# EAGLE design mainboard_teensy41 (EAGLE 9.6.0)
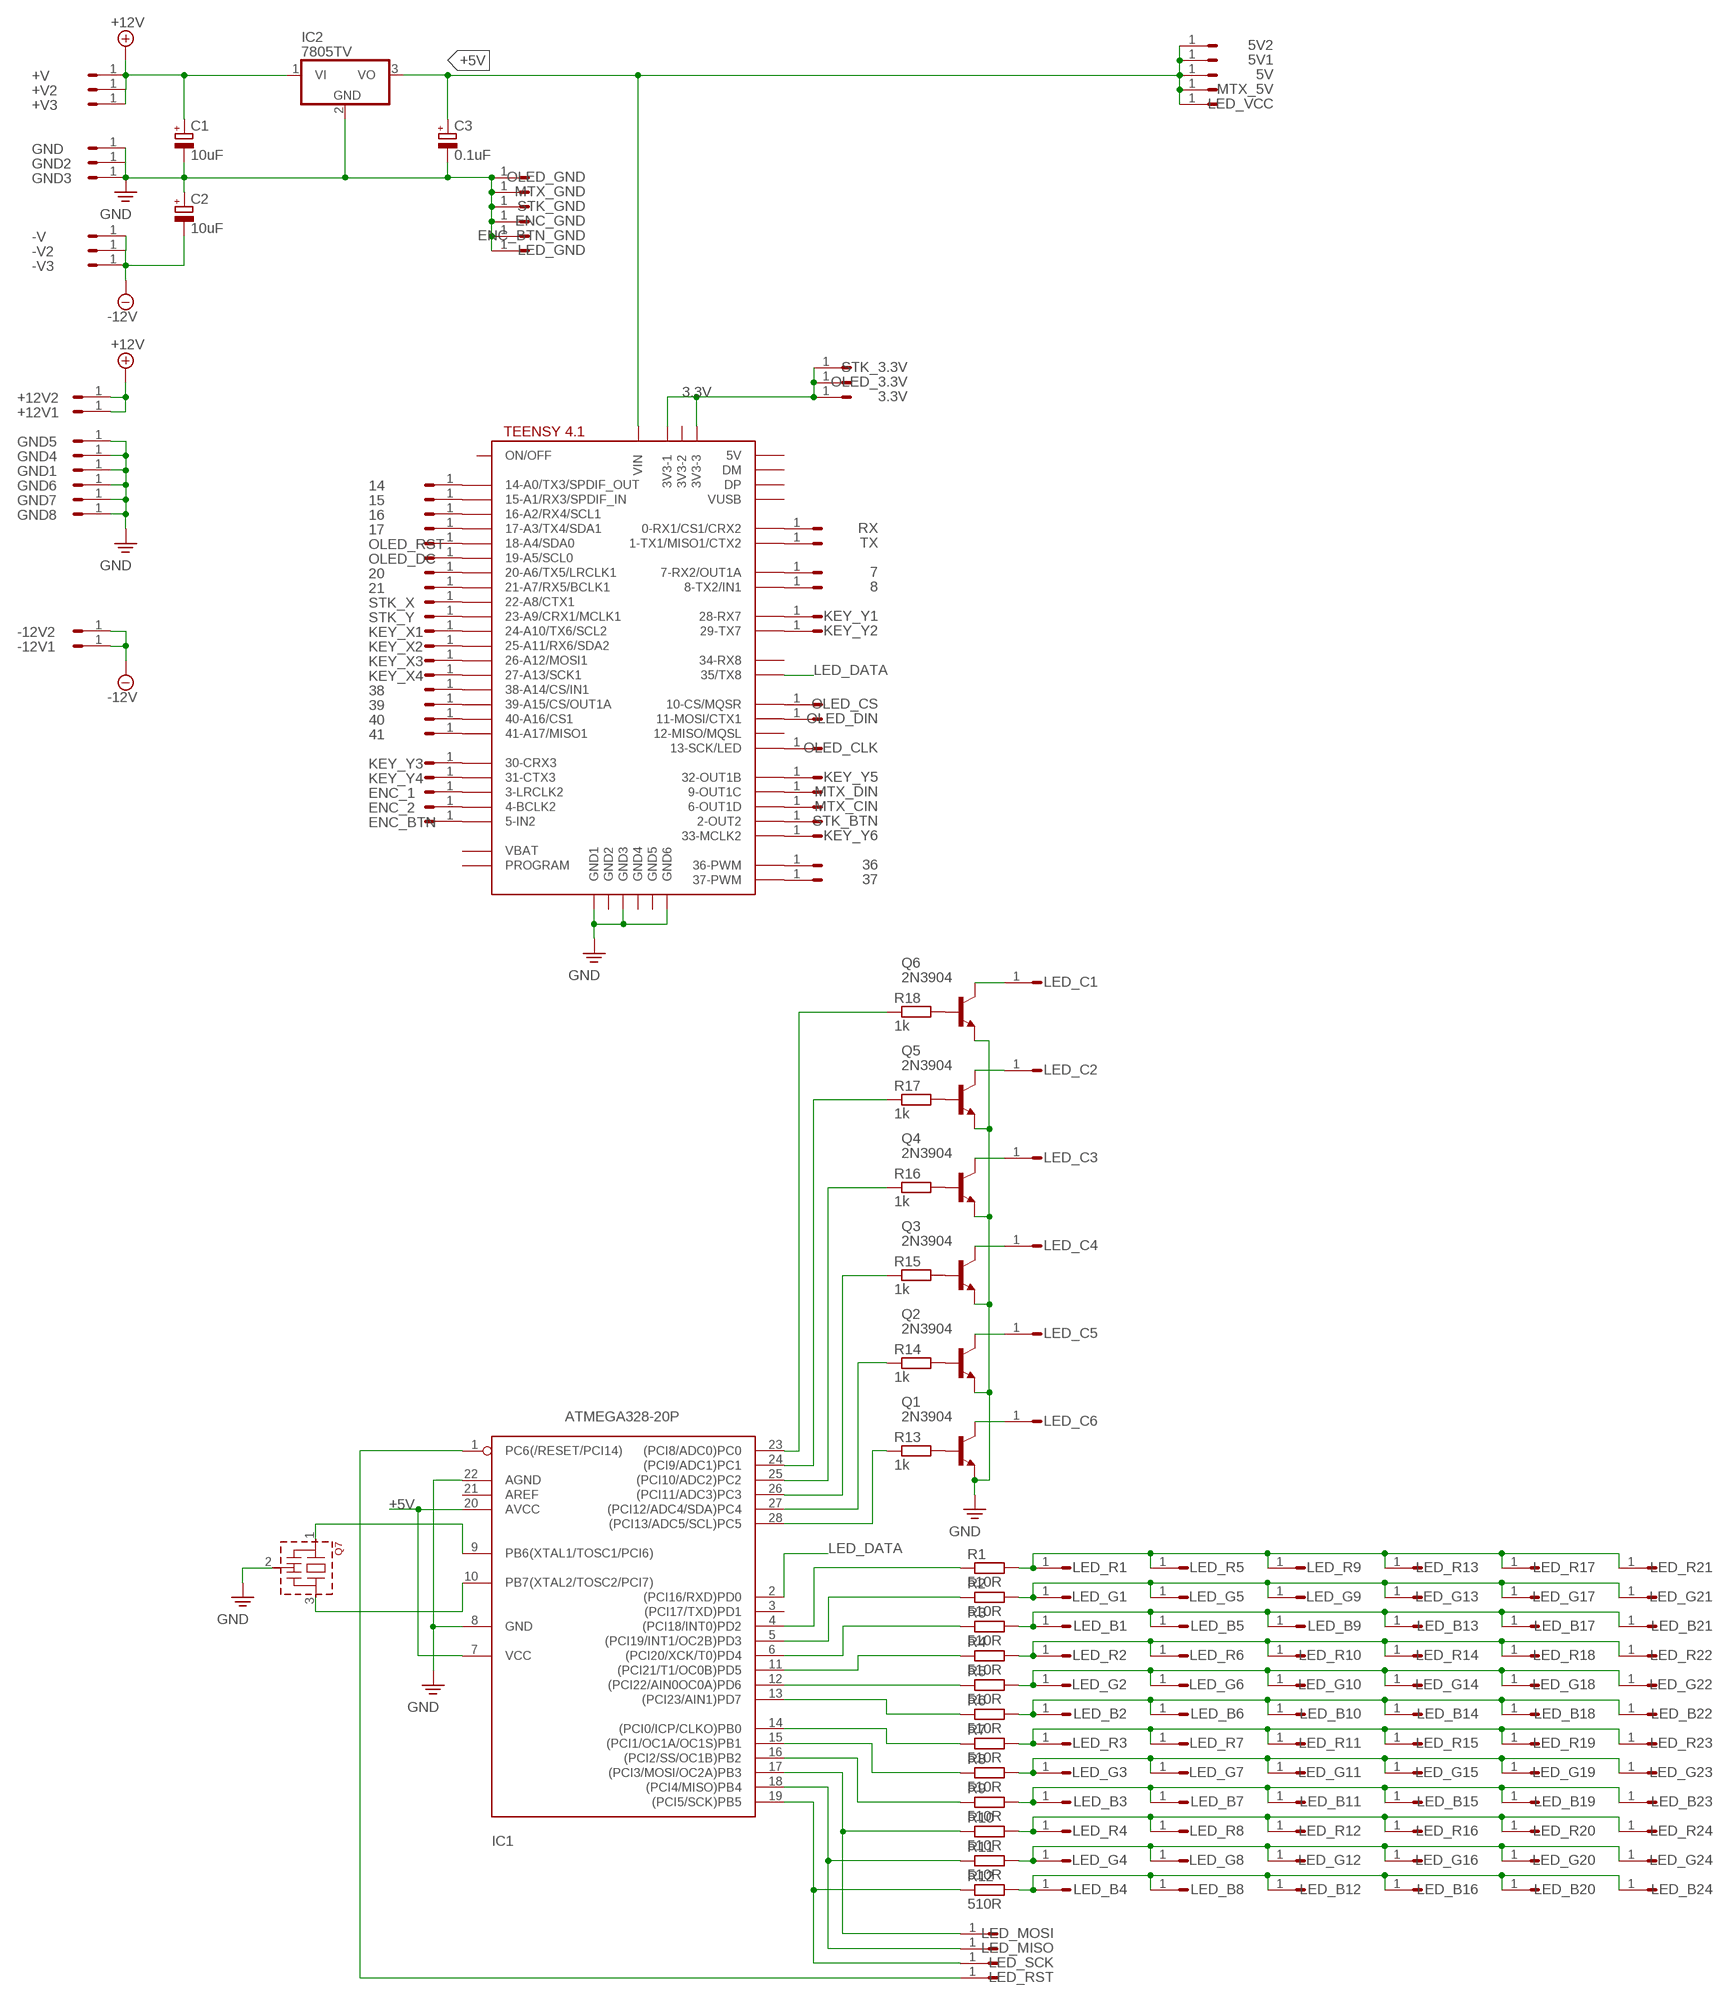
[diagram p0: schematic, sheet 1]

## Parts
3.3V  HEADER/MALE/01  [HEADER/MALE/01]
5V  HEADER/MALE/01  [HEADER/MALE/01]
5V1  HEADER/MALE/01  [HEADER/MALE/01]
5V2  HEADER/MALE/01  [HEADER/MALE/01]
7  HEADER/MALE/01  [HEADER/MALE/01]
8  HEADER/MALE/01  [HEADER/MALE/01]
14  HEADER/MALE/01  [HEADER/MALE/01]
15  HEADER/MALE/01  [HEADER/MALE/01]
16  HEADER/MALE/01  [HEADER/MALE/01]
17  HEADER/MALE/01  [HEADER/MALE/01]
20  HEADER/MALE/01  [HEADER/MALE/01]
21  HEADER/MALE/01  [HEADER/MALE/01]
36  HEADER/MALE/01  [HEADER/MALE/01]
37  HEADER/MALE/01  [HEADER/MALE/01]
38  HEADER/MALE/01  [HEADER/MALE/01]
39  HEADER/MALE/01  [HEADER/MALE/01]
40  HEADER/MALE/01  [HEADER/MALE/01]
41  HEADER/MALE/01  [HEADER/MALE/01]
+12V1  HEADER/MALE/01  [HEADER/MALE/01]
+12V2  HEADER/MALE/01  [HEADER/MALE/01]
+V  HEADER/MALE/01  [HEADER/MALE/01]
+V2  HEADER/MALE/01  [HEADER/MALE/01]
+V3  HEADER/MALE/01  [HEADER/MALE/01]
-12V1  HEADER/MALE/01  [HEADER/MALE/01]
-12V2  HEADER/MALE/01  [HEADER/MALE/01]
-V  HEADER/MALE/01  [HEADER/MALE/01]
-V2  HEADER/MALE/01  [HEADER/MALE/01]
-V3  HEADER/MALE/01  [HEADER/MALE/01]
C1  10uF  CAPACITOR/POLARIZEDE2.5-6  [E2,5-6]
C2  10uF  CAPACITOR/POLARIZEDE2.5-6  [E2,5-6]
C3  0.1uF  CAPACITOR/POLARIZEDE2.5-6  [E2,5-6]
ENC_1  HEADER/MALE/01  [HEADER/MALE/01]
ENC_2  HEADER/MALE/01  [HEADER/MALE/01]
ENC_BTN  HEADER/MALE/01  [HEADER/MALE/01]
ENC_BTN_GND  HEADER/MALE/01  [HEADER/MALE/01]
ENC_GND  HEADER/MALE/01  [HEADER/MALE/01]
GND  HEADER/MALE/01  [HEADER/MALE/01]
GND1  HEADER/MALE/01  [HEADER/MALE/01]
GND2  HEADER/MALE/01  [HEADER/MALE/01]
GND3  HEADER/MALE/01  [HEADER/MALE/01]
GND4  HEADER/MALE/01  [HEADER/MALE/01]
GND5  HEADER/MALE/01  [HEADER/MALE/01]
GND6  HEADER/MALE/01  [HEADER/MALE/01]
GND7  HEADER/MALE/01  [HEADER/MALE/01]
GND8  HEADER/MALE/01  [HEADER/MALE/01]
IC1  ATMEGA328-20P  [DIL28-3]
IC2  7805TV  [TO220V]
KEY_X1  HEADER/MALE/01  [HEADER/MALE/01]
KEY_X2  HEADER/MALE/01  [HEADER/MALE/01]
KEY_X3  HEADER/MALE/01  [HEADER/MALE/01]
KEY_X4  HEADER/MALE/01  [HEADER/MALE/01]
KEY_Y1  HEADER/MALE/01  [HEADER/MALE/01]
KEY_Y2  HEADER/MALE/01  [HEADER/MALE/01]
KEY_Y3  HEADER/MALE/01  [HEADER/MALE/01]
KEY_Y4  HEADER/MALE/01  [HEADER/MALE/01]
KEY_Y5  HEADER/MALE/01  [HEADER/MALE/01]
KEY_Y6  HEADER/MALE/01  [HEADER/MALE/01]
LED_B1  HEADER/MALE/01  [HEADER/MALE/01]
LED_B2  HEADER/MALE/01  [HEADER/MALE/01]
LED_B3  HEADER/MALE/01  [HEADER/MALE/01]
LED_B4  HEADER/MALE/01  [HEADER/MALE/01]
LED_B5  HEADER/MALE/01  [HEADER/MALE/01]
LED_B6  HEADER/MALE/01  [HEADER/MALE/01]
LED_B7  HEADER/MALE/01  [HEADER/MALE/01]
LED_B8  HEADER/MALE/01  [HEADER/MALE/01]
LED_B9  HEADER/MALE/01  [HEADER/MALE/01]
LED_B10  HEADER/MALE/01  [HEADER/MALE/01]
LED_B11  HEADER/MALE/01  [HEADER/MALE/01]
LED_B12  HEADER/MALE/01  [HEADER/MALE/01]
LED_B13  HEADER/MALE/01  [HEADER/MALE/01]
LED_B14  HEADER/MALE/01  [HEADER/MALE/01]
LED_B15  HEADER/MALE/01  [HEADER/MALE/01]
LED_B16  HEADER/MALE/01  [HEADER/MALE/01]
LED_B17  HEADER/MALE/01  [HEADER/MALE/01]
LED_B18  HEADER/MALE/01  [HEADER/MALE/01]
LED_B19  HEADER/MALE/01  [HEADER/MALE/01]
LED_B20  HEADER/MALE/01  [HEADER/MALE/01]
LED_B21  HEADER/MALE/01  [HEADER/MALE/01]
LED_B22  HEADER/MALE/01  [HEADER/MALE/01]
LED_B23  HEADER/MALE/01  [HEADER/MALE/01]
LED_B24  HEADER/MALE/01  [HEADER/MALE/01]
LED_C1  HEADER/MALE/01  [HEADER/MALE/01]
LED_C2  HEADER/MALE/01  [HEADER/MALE/01]
LED_C3  HEADER/MALE/01  [HEADER/MALE/01]
LED_C4  HEADER/MALE/01  [HEADER/MALE/01]
LED_C5  HEADER/MALE/01  [HEADER/MALE/01]
LED_C6  HEADER/MALE/01  [HEADER/MALE/01]
LED_G1  HEADER/MALE/01  [HEADER/MALE/01]
LED_G2  HEADER/MALE/01  [HEADER/MALE/01]
LED_G3  HEADER/MALE/01  [HEADER/MALE/01]
LED_G4  HEADER/MALE/01  [HEADER/MALE/01]
LED_G5  HEADER/MALE/01  [HEADER/MALE/01]
LED_G6  HEADER/MALE/01  [HEADER/MALE/01]
LED_G7  HEADER/MALE/01  [HEADER/MALE/01]
LED_G8  HEADER/MALE/01  [HEADER/MALE/01]
LED_G9  HEADER/MALE/01  [HEADER/MALE/01]
LED_G10  HEADER/MALE/01  [HEADER/MALE/01]
LED_G11  HEADER/MALE/01  [HEADER/MALE/01]
LED_G12  HEADER/MALE/01  [HEADER/MALE/01]
LED_G13  HEADER/MALE/01  [HEADER/MALE/01]
LED_G14  HEADER/MALE/01  [HEADER/MALE/01]
LED_G15  HEADER/MALE/01  [HEADER/MALE/01]
LED_G16  HEADER/MALE/01  [HEADER/MALE/01]
LED_G17  HEADER/MALE/01  [HEADER/MALE/01]
LED_G18  HEADER/MALE/01  [HEADER/MALE/01]
LED_G19  HEADER/MALE/01  [HEADER/MALE/01]
LED_G20  HEADER/MALE/01  [HEADER/MALE/01]
LED_G21  HEADER/MALE/01  [HEADER/MALE/01]
LED_G22  HEADER/MALE/01  [HEADER/MALE/01]
LED_G23  HEADER/MALE/01  [HEADER/MALE/01]
LED_G24  HEADER/MALE/01  [HEADER/MALE/01]
LED_GND  HEADER/MALE/01  [HEADER/MALE/01]
LED_MISO  HEADER/MALE/01  [HEADER/MALE/01]
LED_MOSI  HEADER/MALE/01  [HEADER/MALE/01]
LED_R1  HEADER/MALE/01  [HEADER/MALE/01]
LED_R2  HEADER/MALE/01  [HEADER/MALE/01]
LED_R3  HEADER/MALE/01  [HEADER/MALE/01]
LED_R4  HEADER/MALE/01  [HEADER/MALE/01]
LED_R5  HEADER/MALE/01  [HEADER/MALE/01]
LED_R6  HEADER/MALE/01  [HEADER/MALE/01]
LED_R7  HEADER/MALE/01  [HEADER/MALE/01]
LED_R8  HEADER/MALE/01  [HEADER/MALE/01]
LED_R9  HEADER/MALE/01  [HEADER/MALE/01]
LED_R10  HEADER/MALE/01  [HEADER/MALE/01]
LED_R11  HEADER/MALE/01  [HEADER/MALE/01]
LED_R12  HEADER/MALE/01  [HEADER/MALE/01]
LED_R13  HEADER/MALE/01  [HEADER/MALE/01]
LED_R14  HEADER/MALE/01  [HEADER/MALE/01]
LED_R15  HEADER/MALE/01  [HEADER/MALE/01]
LED_R16  HEADER/MALE/01  [HEADER/MALE/01]
LED_R17  HEADER/MALE/01  [HEADER/MALE/01]
LED_R18  HEADER/MALE/01  [HEADER/MALE/01]
LED_R19  HEADER/MALE/01  [HEADER/MALE/01]
LED_R20  HEADER/MALE/01  [HEADER/MALE/01]
LED_R21  HEADER/MALE/01  [HEADER/MALE/01]
LED_R22  HEADER/MALE/01  [HEADER/MALE/01]
LED_R23  HEADER/MALE/01  [HEADER/MALE/01]
LED_R24  HEADER/MALE/01  [HEADER/MALE/01]
LED_RST  HEADER/MALE/01  [HEADER/MALE/01]
LED_SCK  HEADER/MALE/01  [HEADER/MALE/01]
LED_VCC  HEADER/MALE/01  [HEADER/MALE/01]
MTX_5V  HEADER/MALE/01  [HEADER/MALE/01]
MTX_CIN  HEADER/MALE/01  [HEADER/MALE/01]
MTX_DIN  HEADER/MALE/01  [HEADER/MALE/01]
MTX_GND  HEADER/MALE/01  [HEADER/MALE/01]
OLED_3.3V  HEADER/MALE/01  [HEADER/MALE/01]
OLED_CLK  HEADER/MALE/01  [HEADER/MALE/01]
OLED_CS  HEADER/MALE/01  [HEADER/MALE/01]
OLED_DC  HEADER/MALE/01  [HEADER/MALE/01]
OLED_DIN  HEADER/MALE/01  [HEADER/MALE/01]
OLED_GND  HEADER/MALE/01  [HEADER/MALE/01]
OLED_RST  HEADER/MALE/01  [HEADER/MALE/01]
Q1  2N3904  [TO92]
Q2  2N3904  [TO92]
Q3  2N3904  [TO92]
Q4  2N3904  [TO92]
Q5  2N3904  [TO92]
Q6  2N3904  [TO92]
Q7  CSTLS_G  [CSTLS_G8]
R1  510R  RESISTORRESISTOR/UPRIGHT/7.5  [RESISTOR/7.5]
R2  510R  RESISTORRESISTOR/UPRIGHT/7.5  [RESISTOR/7.5]
R3  510R  RESISTORRESISTOR/UPRIGHT/7.5  [RESISTOR/7.5]
R4  510R  RESISTORRESISTOR/UPRIGHT/7.5  [RESISTOR/7.5]
R5  510R  RESISTORRESISTOR/UPRIGHT/7.5  [RESISTOR/7.5]
R6  510R  RESISTORRESISTOR/UPRIGHT/7.5  [RESISTOR/7.5]
R7  510R  RESISTORRESISTOR/UPRIGHT/7.5  [RESISTOR/7.5]
R8  510R  RESISTORRESISTOR/UPRIGHT/7.5  [RESISTOR/7.5]
R9  510R  RESISTORRESISTOR/UPRIGHT/7.5  [RESISTOR/7.5]
R10  510R  RESISTORRESISTOR/UPRIGHT/7.5  [RESISTOR/7.5]
R11  510R  RESISTORRESISTOR/UPRIGHT/7.5  [RESISTOR/7.5]
R12  510R  RESISTORRESISTOR/UPRIGHT/7.5  [RESISTOR/7.5]
R13  1k  RESISTORRESISTOR/UPRIGHT/7.5  [RESISTOR/7.5]
R14  1k  RESISTORRESISTOR/UPRIGHT/7.5  [RESISTOR/7.5]
R15  1k  RESISTORRESISTOR/UPRIGHT/7.5  [RESISTOR/7.5]
R16  1k  RESISTORRESISTOR/UPRIGHT/7.5  [RESISTOR/7.5]
R17  1k  RESISTORRESISTOR/UPRIGHT/7.5  [RESISTOR/7.5]
R18  1k  RESISTORRESISTOR/UPRIGHT/7.5  [RESISTOR/7.5]
RX  HEADER/MALE/01  [HEADER/MALE/01]
STK_3.3V  HEADER/MALE/01  [HEADER/MALE/01]
STK_BTN  HEADER/MALE/01  [HEADER/MALE/01]
STK_GND  HEADER/MALE/01  [HEADER/MALE/01]
STK_X  HEADER/MALE/01  [HEADER/MALE/01]
STK_Y  HEADER/MALE/01  [HEADER/MALE/01]
TX  HEADER/MALE/01  [HEADER/MALE/01]
U$1  TEENSY41-E  [TENNSY41-E]

## Nets
3.3V: 3.3V.1 OLED_3.3V.1 STK_3.3V.1 U$1.3V3-1 U$1.3V3-3
+5V: 5V1.1 5V2.1 5V.1 C3.+ IC1.7(VCC) IC1.20(AVCC) IC2.3(VO) LED_VCC.1 MTX_5V.1 U$1.VIN
+12V: +12V1.1 +12V2.1 +V2.1 +V3.1 +V.1 C1.+ IC2.1(VI)
-12V: -12V1.1 -12V2.1 -V2.1 -V3.1 -V.1 C2.-
GND: C1.- C2.+ C3.- ENC_BTN_GND.1 ENC_GND.1 GND1.1 GND2.1 GND3.1 GND4.1 GND5.1 GND6.1 GND7.1 GND8.1 GND.1 IC1.8(GND) IC1.22(AGND) IC2.2(GND) LED_GND.1 MTX_GND.1 OLED_GND.1 Q1.3(E) Q2.3(E) Q3.3(E) Q4.3(E) Q5.3(E) Q6.3(E) Q7.2(VSS) STK_GND.1 U$1.GND1 U$1.GND3 U$1.GND6
LED_DATA: IC1.2((PCI16/RXD)PD0) U$1.35-TX8(35/TX8)
N$1: IC1.4((PCI18/INT0)PD2) R1.1
N$2: OLED_CS.1 U$1.10-CS\MQSR(10-CS/MQSR)
N$3: OLED_DIN.1 U$1.11-MOSI/CTX1
N$4: OLED_CLK.1 U$1.13-SCK/LED
N$5: RX.1 U$1.0-RX1/CS1/CRX2
N$6: TX.1 U$1.1-TX1/MISO1/CTX2
N$7: KEY_X1.1 U$1.24-A10/TX6/SCL2
N$8: KEY_X2.1 U$1.25-A11/RX6/SDA2
N$9: KEY_Y1.1 U$1.28-RX7
N$10: KEY_Y2.1 U$1.29-TX7
N$11: KEY_Y5.1 U$1.32-OUT1B
N$12: KEY_X3.1 U$1.26-A12/MOSI1
N$13: MTX_CIN.1 U$1.6-OUT1D
N$14: STK_BTN.1 U$1.2-OUT2
N$15: KEY_Y6.1 U$1.33-MCLK2
N$16: KEY_Y3.1 U$1.30-CRX3
N$17: KEY_Y4.1 U$1.31-CTX3
N$18: ENC_1.1 U$1.3-LRCLK2
N$19: ENC_2.1 U$1.4-BCLK2
N$20: ENC_BTN.1 U$1.5-IN2
N$21: KEY_X4.1 U$1.27-A13/SCK1
N$22: STK_X.1 U$1.22-A8/CTX1
N$23: STK_Y.1 U$1.23-A9/CRX1/MCLK1
N$24: OLED_RST.1 U$1.18-A4/SDA0
N$25: OLED_DC.1 U$1.19-A5/SCL0
N$26: 14.1 U$1.14-A0/TX3/SPDIF_OUT
N$27: IC1.5((PCI19/INT1/OC2B)PD3) R2.1
N$28: IC1.6((PCI20/XCK/T0)PD4) R3.1
N$29: IC1.11((PCI21/T1/OC0B)PD5) R4.1
N$30: IC1.12((PCI22/AIN0OC0A)PD6) R5.1
N$31: IC1.13((PCI23/AIN1)PD7) R6.1
N$32: IC1.14((PCI0/ICP/CLKO)PB0) R7.1
N$33: IC1.15((PCI1/OC1A/OC1S)PB1) R8.1
N$34: IC1.16((PCI2/SS/OC1B)PB2) R9.1
N$35: IC1.17((PCI3/MOSI/OC2A)PB3) LED_MOSI.1 R10.1
N$36: IC1.18((PCI4/MISO)PB4) LED_MISO.1 R11.1
N$37: 15.1 U$1.15-A1/RX3/SPDIF_IN
N$38: IC1.1(PC6(/RESET/PCI14)) LED_RST.1
N$39: LED_R1.1 LED_R5.1 LED_R9.1 LED_R13.1 LED_R17.1 LED_R21.1 R1.2
N$40: LED_G1.1 LED_G5.1 LED_G9.1 LED_G13.1 LED_G17.1 LED_G21.1 R2.2
N$41: LED_B1.1 LED_B5.1 LED_B9.1 LED_B13.1 LED_B17.1 LED_B21.1 R3.2
N$42: LED_R2.1 LED_R6.1 LED_R10.1 LED_R14.1 LED_R18.1 LED_R22.1 R4.2
N$43: LED_G2.1 LED_G6.1 LED_G10.1 LED_G14.1 LED_G18.1 LED_G22.1 R5.2
N$44: LED_B2.1 LED_B6.1 LED_B10.1 LED_B14.1 LED_B18.1 LED_B22.1 R6.2
N$45: LED_R3.1 LED_R7.1 LED_R11.1 LED_R15.1 LED_R19.1 LED_R23.1 R7.2
N$46: LED_G3.1 LED_G7.1 LED_G11.1 LED_G15.1 LED_G19.1 LED_G23.1 R8.2
N$47: LED_B3.1 LED_B7.1 LED_B11.1 LED_B15.1 LED_B19.1 LED_B23.1 R9.2
N$48: LED_R4.1 LED_R8.1 LED_R12.1 LED_R16.1 LED_R20.1 LED_R24.1 R10.2
N$49: LED_G4.1 LED_G8.1 LED_G12.1 LED_G16.1 LED_G20.1 LED_G24.1 R11.2
N$50: LED_B4.1 LED_B8.1 LED_B12.1 LED_B16.1 LED_B20.1 LED_B24.1 R12.2
N$51: Q1.2(B) R13.2
N$52: IC1.28((PCI13/ADC5/SCL)PC5) R13.1
N$53: Q2.2(B) R14.2
N$54: Q3.2(B) R15.2
N$55: Q4.2(B) R16.2
N$56: Q5.2(B) R17.2
N$57: Q6.2(B) R18.2
N$58: IC1.27((PCI12/ADC4/SDA)PC4) R14.1
N$59: IC1.26((PCI11/ADC3)PC3) R15.1
N$60: IC1.25((PCI10/ADC2)PC2) R16.1
N$61: IC1.24((PCI9/ADC1)PC1) R17.1
N$62: IC1.23((PCI8/ADC0)PC0) R18.1
N$63: LED_C1.1 Q6.1(C)
N$64: LED_C2.1 Q5.1(C)
N$65: LED_C3.1 Q4.1(C)
N$66: 36.1 U$1.36-PWM
N$67: 37.1 U$1.37-PWM
N$68: LED_C4.1 Q3.1(C)
N$69: LED_C5.1 Q2.1(C)
N$70: LED_C6.1 Q1.1(C)
N$71: 16.1 U$1.16-A2/RX4/SCL1
N$72: 17.1 U$1.17-A3/TX4/SDA1
N$73: 7.1 U$1.7-RX2/OUT1A
N$74: 8.1 U$1.8-TX2/IN1
N$75: 20.1 U$1.20-A6/TX5/LRCLK1
N$76: 21.1 U$1.21-A7/RX5/BCLK1
N$77: MTX_DIN.1 U$1.9-OUT1C
N$79: 38.1 U$1.38-A14/CS/IN1
N$80: 39.1 U$1.39-A15/CS/OUT1A
N$81: 40.1 U$1.40-A16/CS1
N$82: 41.1 U$1.41-A17/MISO1
N$83: IC1.9(PB6(XTAL1/TOSC1/PCI6)) Q7.1
N$84: IC1.10(PB7(XTAL2/TOSC2/PCI7)) Q7.3
N$86: IC1.19((PCI5/SCK)PB5) LED_SCK.1 R12.1
Unconnected: IC1.3((PCI17/TXD)PD1) IC1.21(AREF) U$1.3V3-2 U$1.12-MISO/MQSL U$1.34-RX8 U$1.+5V(5V) U$1.DM U$1.DP U$1.GND2 U$1.GND4 U$1.GND5 U$1.ON/OFF U$1.PROGRAM U$1.VBAT U$1.VUSB

## Library data of the parts
3.3V 5V 5V1 5V2 7 8 14-17 20 21 36-41 +12V1 +12V2 +V +V2 +V3 -12V1 -12V2 -V -V2 -V3 ENC_1 ENC_2 ENC_BTN ENC_BTN_GND ENC_GND GND GND1-GND8 KEY_X1-KEY_X4 KEY_Y1-KEY_Y6 LED_B1-LED_B24 LED_C1-LED_C6 LED_G1-LED_G24 LED_GND LED_MISO LED_MOSI LED_R1-LED_R24 LED_RST LED_SCK LED_VCC MTX_5V MTX_CIN MTX_DIN MTX_GND OLED_3.3V OLED_CLK OLED_CS OLED_DC OLED_DIN OLED_GND OLED_RST RX STK_3.3V STK_BTN STK_GND STK_X STK_Y TX = connectors:HEADER/MALE/01; SPICEPREFIX: X
C1-C3 = capacitors:CAPACITOR/POLARIZED: POLARIZED CAPACITOR, European symbol; SPICEPREFIX: C
IC1 = atmega328:ATMEGA328*P: MICROCONTROLLER 32 kBytes FLASH 2 kBytes SRAM 1 kBytes EEPROM USART 8-channel 10 bit ADC
IC2 = ic_voltage_reg:78*: Positive VOLTAGE REGULATOR Source: http://cache.national.com/ds/LM/LM78L05.pdf http://www.fairchildsemi.com/ds/LM/LM7805.pdf
Q1-Q6 = transistors:2N3904: NPN Transistor
Q7 = capacitors:CSTLS_G: Ceramic resonator 2.00 to 10.00 MHz
R1-R18 = resistors:RESISTOR: RESISTOR, European symbol
U$1 = teensy:TEENSY41-E

## Board
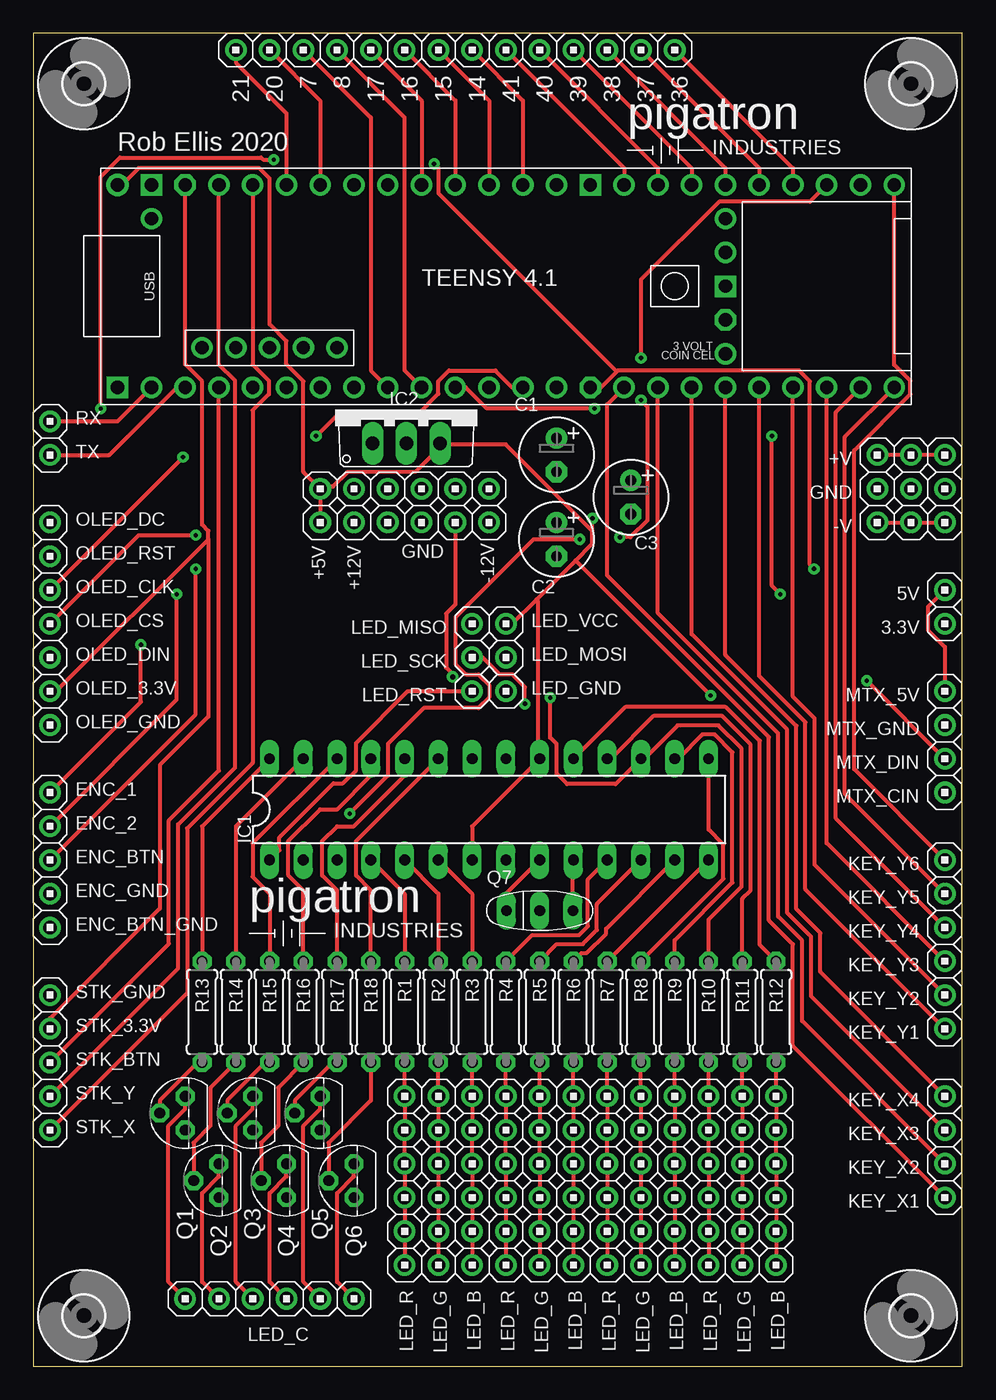
[diagram p1: board, top side]
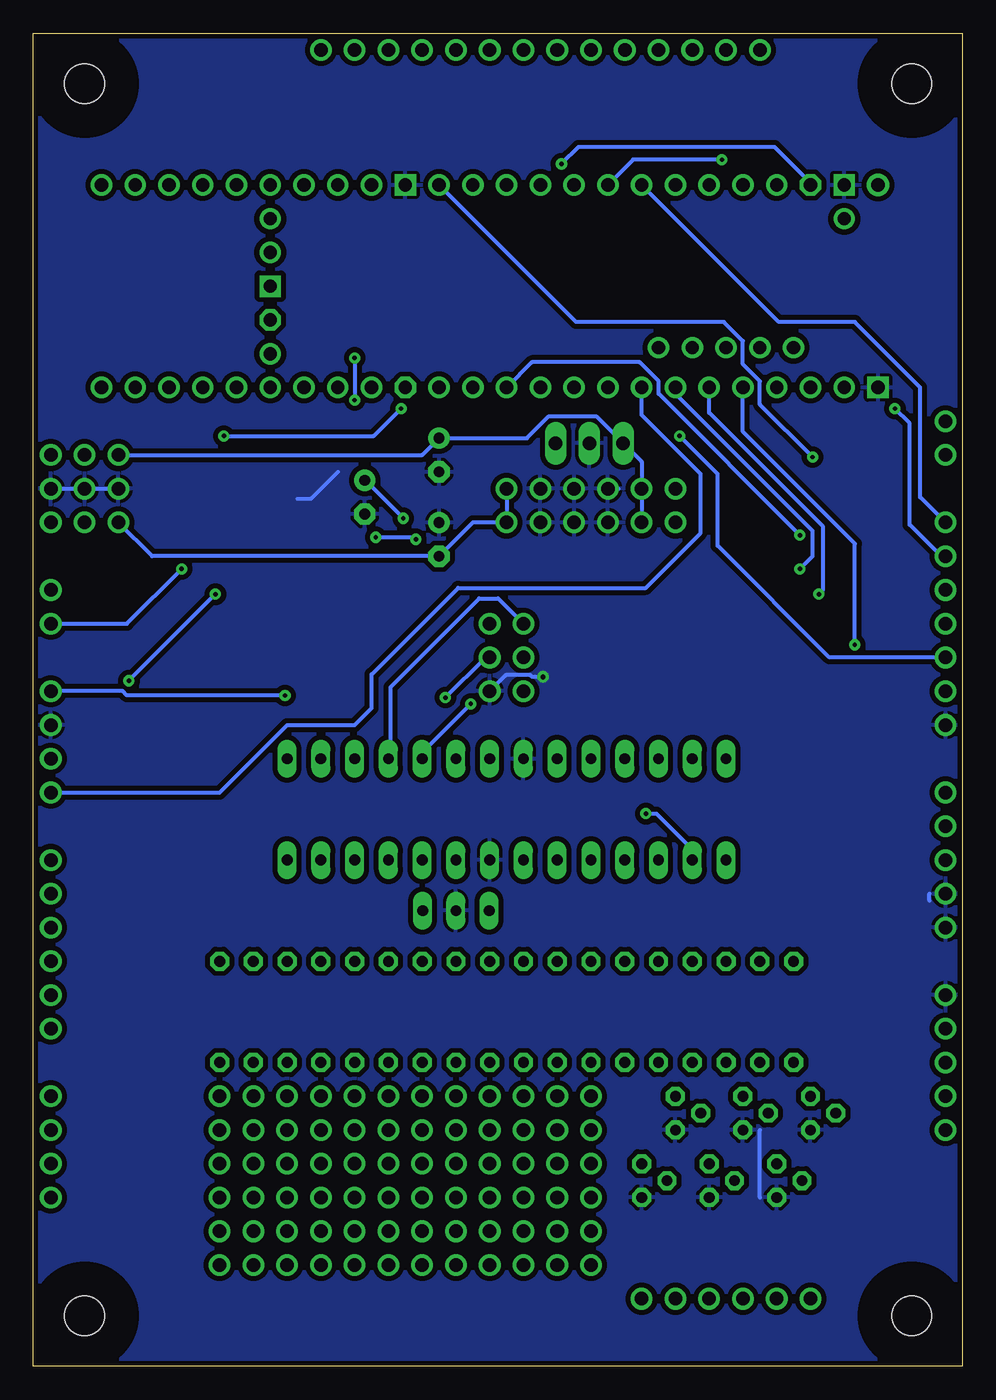
[diagram p2: board, bottom side, seen from below]

Size 69.9 x 100.32 mm. Coordinates in mm from the lower left corner, seen from the top.
Outline: 0,0 69.9,0 69.9,100.32 0,100.32 0,0
Copper layers (1*16): Top 0.0356mm / dielectric 1.5011mm / Bottom 0.0356mm
Design rules "pigatron": minimum track width 12mil, minimum drill 13mil, track to track 15mil, track to pad 10mil, pad to pad 10mil, via to via 10mil, smd to smd 6mil, copper to edge 15mil, drill to drill 10mil, minimum pad ring 12mil, minimum via ring 10mil, stop-mask expansion 4mil, vias tented up to drill 0mil, thermal gap 10mil

### Footprints (pad centres in the part's own frame; a part is rotated, then mirrored left to right if it is on the bottom)
HEADER/MALE/01 = drill 1.016: 1 0,0
E2,5-6 = drill 0.813 pad 1.6: + -1.27,0 | drill 0.813 pad 1.6 octagon: - 1.27,0
DIL28-3 = drill 0.813 long: 1 -16.51,-3.81; 2 -13.97,-3.81; 3 -11.43,-3.81; 4 -8.89,-3.81; 5 -6.35,-3.81; 6 -3.81,-3.81; 7 -1.27,-3.81; 8 1.27,-3.81; 9 3.81,-3.81; 10 6.35,-3.81; 11 8.89,-3.81; 12 11.43,-3.81; 13 13.97,-3.81; 14 16.51,-3.81; 15 16.51,3.81; 16 13.97,3.81; 17 11.43,3.81; 18 8.89,3.81; 19 6.35,3.81; 20 3.81,3.81; 21 1.27,3.81; 22 -1.27,3.81; 23 -3.81,3.81; 24 -6.35,3.81; 25 -8.89,3.81; 26 -11.43,3.81; 27 -13.97,3.81; 28 -16.51,3.81
TO220V = drill 1.016 long: 1 -2.54,-2.54; 2 0,-2.54; 3 2.54,-2.54
TO92 = drill 0.813 octagon: 1 1.27,0; 2 0,1.905; 3 -1.27,0
CSTLS_G8 = drill 0.813 long: 1 -2.5,0; 2 0,0; 3 2.5,0
RESISTOR/7.5 = drill 0.813 octagon: 1 -3.81,0; 2 3.81,0
TENNSY41-E = drill 1: 0-RX1/CS1/CRX2 -27.94,-7.62; 1-TX1/MISO1/CTX2 -25.4,-7.62; 2-OUT2 -22.86,-7.62; 3-LRCLK2 -20.32,-7.62; 4-BCLK2 -17.78,-7.62; 5-IN2 -15.24,-7.62; 6-OUT1D -12.7,-7.62; 7-RX2/OUT1A -10.16,-7.62; 8-TX2/IN1 -7.62,-7.62; 9-OUT1C -5.08,-7.62; 10-CS\MQSR -2.54,-7.62; 11-MOSI/CTX1 0,-7.62; 12-MISO/MQSL 2.54,-7.62; 13-SCK/LED 2.54,7.62; 14-A0/TX3/SPDIF_OUT 0,7.62; 15-A1/RX3/SPDIF_IN -2.54,7.62; 16-A2/RX4/SCL1 -5.08,7.62; 17-A3/TX4/SDA1 -7.62,7.62; 18-A4/SDA0 -10.16,7.62; 19-A5/SCL0 -12.7,7.62; 20-A6/TX5/LRCLK1 -15.24,7.62; 21-A7/RX5/BCLK1 -17.78,7.62; 22-A8/CTX1 -20.32,7.62; 23-A9/CRX1/MCLK1 -22.86,7.62; 24-A10/TX6/SCL2 7.62,-7.62; 25-A11/RX6/SDA2 10.16,-7.62; 26-A12/MOSI1 12.7,-7.62; 27-A13/SCK1 15.24,-7.62; 28-RX7 17.78,-7.62; 29-TX7 20.32,-7.62; 30-CRX3 22.86,-7.62; 31-CTX3 25.4,-7.62; 32-OUT1B 27.94,-7.62; 33-MCLK2 27.94,7.62; 34-RX8 25.4,7.62; 35-TX8 22.86,7.62; 36-PWM 20.32,7.62; 37-PWM 17.78,7.62; 38-A14/CS/IN1 15.24,7.62; 39-A15/CS/OUT1A 12.7,7.62; 40-A16/CS1 10.16,7.62; 41-A17/MISO1 7.62,7.62; +5V -24.13,-4.62; DM -21.59,-4.62; DP -19.05,-4.62; GND4 -16.51,-4.62; GND5 -13.97,-4.62; ON/OFF 15.24,5.08; PROGRAM 15.24,2.54; VBAT 15.24,-5.08; VUSB -27.94,5.08 | drill 1 octagon: 3V3-1 5.08,-7.62; 3V3-2 15.24,-2.54; 3V3-3 -25.4,7.62 | drill 1 square: GND1 -30.48,-7.62; GND2 15.24,0; GND3 5.08,7.62; GND6 -27.94,7.62 | drill 1 pad 1.676: VIN -30.48,7.62
STANDOFF/3.0 = hole 3: 0,0

### Placement (x,y rotation side)
3.3V  68.58,55.88 180 top
5V  68.58,58.42 180 top
5V1  21.59,66.04 0 top
5V2  21.59,63.5 0 top
7  20.32,99.06 270 top
8  22.86,99.06 270 top
14  33.02,99.06 270 top
15  30.48,99.06 270 top
16  27.94,99.06 270 top
17  25.4,99.06 270 top
20  17.78,99.06 270 top
21  15.24,99.06 270 top
36  48.26,99.06 270 top
37  45.72,99.06 270 top
38  43.18,99.06 270 top
39  40.64,99.06 270 top
40  38.1,99.06 270 top
41  35.56,99.06 270 top
+12V1  24.13,66.04 0 top
+12V2  24.13,63.5 0 top
+V  63.5,68.58 180 top
+V2  66.04,68.58 0 top
+V3  68.58,68.58 0 top
-12V1  34.29,66.04 0 top
-12V2  34.29,63.5 0 top
-V  63.5,63.5 180 top
-V2  66.04,63.5 0 top
-V3  68.58,63.5 0 top
C1  39.37,68.58 270 top
C2  39.37,62.23 270 top
C3  44.96,65.41 270 top
ENC_1  1.27,43.18 0 top
ENC_2  1.27,40.64 0 top
ENC_BTN  1.27,38.1 0 top
ENC_BTN_GND  1.27,33.02 0 top
ENC_GND  1.27,35.56 0 top
GND  63.5,66.04 180 top
GND1  29.21,66.04 0 top
GND2  68.58,66.04 0 top
GND3  66.04,66.04 0 top
GND4  29.21,63.5 0 top
GND5  31.75,66.04 0 top
GND6  31.75,63.5 0 top
GND7  26.67,66.04 0 top
GND8  26.67,63.5 0 top
IC1  34.29,41.91 0 top
IC2  28.07,72.01 0 top
KEY_X1  68.58,12.7 180 top
KEY_X2  68.58,15.24 180 top
KEY_X3  68.58,17.78 180 top
KEY_X4  68.58,20.32 180 top
KEY_Y1  68.58,25.4 180 top
KEY_Y2  68.58,27.94 180 top
KEY_Y3  68.58,30.48 180 top
KEY_Y4  68.58,33.02 180 top
KEY_Y5  68.58,35.56 180 top
KEY_Y6  68.58,38.1 180 top
LED_B1  33.02,20.32 0 top
LED_B2  40.64,20.32 0 top
LED_B3  48.26,20.32 0 top
LED_B4  55.88,20.32 0 top
LED_B5  33.02,17.78 0 top
LED_B6  40.64,17.78 0 top
LED_B7  48.26,17.78 0 top
LED_B8  55.88,17.78 0 top
LED_B9  33.02,15.24 0 top
LED_B10  40.64,15.24 0 top
LED_B11  48.26,15.24 0 top
LED_B12  55.88,15.24 0 top
LED_B13  33.02,12.7 0 top
LED_B14  40.64,12.7 0 top
LED_B15  48.26,12.7 0 top
LED_B16  55.88,12.7 0 top
LED_B17  33.02,10.16 0 top
LED_B18  40.64,10.16 0 top
LED_B19  48.26,10.16 0 top
LED_B20  55.88,10.16 0 top
LED_B21  33.02,7.62 0 top
LED_B22  40.64,7.62 0 top
LED_B23  48.26,7.62 0 top
LED_B24  55.88,7.62 0 top
LED_C1  24.13,5.08 0 top
LED_C2  21.59,5.08 0 top
LED_C3  19.05,5.08 0 top
LED_C4  16.51,5.08 0 top
LED_C5  13.97,5.08 0 top
LED_C6  11.43,5.08 0 top
LED_G1  30.48,20.32 0 top
LED_G2  38.1,20.32 0 top
LED_G3  45.72,20.32 0 top
LED_G4  53.34,20.32 0 top
LED_G5  30.48,17.78 0 top
LED_G6  38.1,17.78 0 top
LED_G7  45.72,17.78 0 top
LED_G8  53.34,17.78 0 top
LED_G9  30.48,15.24 0 top
LED_G10  38.1,15.24 0 top
LED_G11  45.72,15.24 0 top
LED_G12  53.34,15.24 0 top
LED_G13  30.48,12.7 0 top
LED_G14  38.1,12.7 0 top
LED_G15  45.72,12.7 0 top
LED_G16  53.34,12.7 0 top
LED_G17  30.48,10.16 0 top
LED_G18  38.1,10.16 0 top
LED_G19  45.72,10.16 0 top
LED_G20  53.34,10.16 0 top
LED_G21  30.48,7.62 0 top
LED_G22  38.1,7.62 0 top
LED_G23  45.72,7.62 0 top
LED_G24  53.34,7.62 0 top
LED_GND  35.56,50.8 0 top
LED_MISO  33.02,55.88 180 top
LED_MOSI  35.56,53.34 0 top
LED_R1  27.94,20.32 0 top
LED_R2  35.56,20.32 0 top
LED_R3  43.18,20.32 0 top
LED_R4  50.8,20.32 0 top
LED_R5  27.94,17.78 0 top
LED_R6  35.56,17.78 0 top
LED_R7  43.18,17.78 0 top
LED_R8  50.8,17.78 0 top
LED_R9  27.94,15.24 0 top
LED_R10  35.56,15.24 0 top
LED_R11  43.18,15.24 0 top
LED_R12  50.8,15.24 0 top
LED_R13  27.94,12.7 0 top
LED_R14  35.56,12.7 0 top
LED_R15  43.18,12.7 0 top
LED_R16  50.8,12.7 0 top
LED_R17  27.94,10.16 0 top
LED_R18  35.56,10.16 0 top
LED_R19  43.18,10.16 0 top
LED_R20  50.8,10.16 0 top
LED_R21  27.94,7.62 0 top
LED_R22  35.56,7.62 0 top
LED_R23  43.18,7.62 0 top
LED_R24  50.8,7.62 0 top
LED_RST  33.02,50.8 180 top
LED_SCK  33.02,53.34 180 top
LED_VCC  35.56,55.88 0 top
MTX_5V  68.58,50.8 180 top
MTX_CIN  68.58,43.18 180 top
MTX_DIN  68.58,45.72 180 top
MTX_GND  68.58,48.26 180 top
OLED_3.3V  1.27,50.8 0 top
OLED_CLK  1.27,58.42 0 top
OLED_CS  1.27,55.88 0 top
OLED_DC  1.27,63.5 0 top
OLED_DIN  1.27,53.34 0 top
OLED_GND  1.27,48.26 0 top
OLED_RST  1.27,60.96 0 top
Q1  11.43,19.05 90 top
Q2  13.97,13.97 90 top
Q3  16.51,19.05 90 top
Q4  19.05,13.97 90 top
Q5  21.59,19.05 90 top
Q6  24.13,13.97 90 top
Q7  38.1,34.29 0 top
R1  27.94,26.67 270 top
R2  30.48,26.67 270 top
R3  33.02,26.67 270 top
R4  35.56,26.67 270 top
R5  38.1,26.67 270 top
R6  40.64,26.67 270 top
R7  43.18,26.67 270 top
R8  45.72,26.67 270 top
R9  48.26,26.67 270 top
R10  50.8,26.67 270 top
R11  53.34,26.67 270 top
R12  55.88,26.67 270 top
R13  12.7,26.67 270 top
R14  15.24,26.67 270 top
R15  17.78,26.67 270 top
R16  20.32,26.67 270 top
R17  22.86,26.67 270 top
R18  25.4,26.67 270 top
RX  1.27,71.12 0 top
STK_3.3V  1.27,25.4 0 top
STK_BTN  1.27,22.86 0 top
STK_GND  1.27,27.94 0 top
STK_X  1.27,17.78 0 top
STK_Y  1.27,20.32 0 top
TX  1.27,68.58 0 top
U$1  36.83,81.28 0 top
U$2  [STANDOFF/3.0]  3.81,96.52 0 top
U$3  [STANDOFF/3.0]  66.04,96.52 0 top
U$4  [STANDOFF/3.0]  66.04,3.81 0 top
U$5  [PIGATRON-LOGO]  53.59,93.09 0 top
U$7  [STANDOFF/3.0]  3.81,3.81 0 top
U$8  [PIGATRON-LOGO]  25.15,34.16 0 top

### Tracks (layer width: path | path; a pad name or v marks a point on that pad's centre or on a via)
3.3V  (via drill 0.33)
  Top 0.305: U$1.3V3-1 42.7,73.66 43.89,74.85 | 43.89,74.85 43.97,74.93 57.63,74.93 58.42,74.14 58.42,60.33 v58.74,60.01 | U$1.3V3-3 11.43,75.41 12.7,74.14 12.7,63.34 13.18,62.87 13.18,62.23 13.1,62.15 | 13.1,62.15 1.75,50.8 OLED_3.3V.1 | STK_3.3V.1 1.27,26.19 9.53,34.45 9.53,45.24 13.18,48.9 13.18,62.07 13.1,62.15 | 43.89,74.85 30.48,88.27 30.48,90.17 v30.16,90.49
  Bottom 0.305: v58.74,60.01 62.87,55.88 3.3V.1 | v30.16,90.49 28.89,91.76 14.13,91.76 11.43,89.06 U$1.3V3-3
+5V  (via drill 0.33)
  Top 0.305: IC1.7 33.02,40.64 IC1.20 37.94,45.72 37.94,57.63 37.86,57.71 | 5V1.1 5V2.1 | U$1.VIN 6.67,88.9 7.94,90.17 16.99,90.17 17.78,89.38 17.78,78.42 19.05,77.15 19.05,75.41 20.32,74.14 20.32,67.31 5V1.1 | MTX_5V.1 68.58,54.13 67.31,55.4 67.31,57.15 5V.1 | 42.07,62.87 42.07,61.91 40.8,60.64 | 42.07,62.87 v42.07,63.82 | 37.86,57.71 36.04,55.88 LED_VCC.1 | 37.86,57.71 40.8,60.64 | 42.07,62.87 35.56,69.37 30.64,69.37 IC2.3 30.64,69.22 28.73,67.31 23.65,67.31 22.54,66.2 21.59,66.2 5V1.1 | 40.8,60.64 v50.96,50.48
  Bottom 0.305: v42.07,63.82 44.93,66.67 C3.+ | MTX_5V.1 63.18,50.8 62.87,50.48 v50.96,50.48
+12V
  Top 0.305: +V3.1 +V2.1 +V.1
  Bottom 0.305: +V.1 40.64,68.58 C1.+ 32.76,69.85 31.11,71.5 27.56,71.5 IC2.1 24.13,68.07 +12V1.1 +12V2.1
-12V
  Top 0.305: -V.1 -V2.1 -V3.1
  Bottom 0.305: -12V1.1 -12V2.1 36.83,63.5 C2.- 60.96,60.96 -V.1
GND  (via drill 0.35)
  Top 0.305: GND6.1 31.75,57.33 31.06,56.64 31.06,52.58 31.66,51.98 v31.56,51.88
  Bottom 0.305: GND2.1 GND3.1 GND.1 | 50.04,65.28 49.02,65.28 46.99,67.31 | 2.49,35.05 2.49,35.56 | GND7.1 25.85,66.04 | 15.24,12.7 15.24,17.78 | v31.56,51.88 32.37,51.88 32.52,52.02 34.34,52.02 LED_GND.1
  pour Bottom: 0,100.33 69.85,100.33 69.85,0 0,0
LED_DATA  (via drill 0.33)
  Top 0.305: v23.81,41.59 26.67,44.45 26.67,46.83 29.37,49.53 33.5,49.53 34.29,50.32 34.29,51.28 33.5,52.07 32.54,52.07 31.75,52.86 31.75,56.36 37.62,62.23 v41.12,62.23 | v44.13,62.39 44.93,62.39 46.2,63.66 46.2,72.23 v45.72,72.71 | v45.72,75.88 45.72,81.76 51.59,87.63 58.42,87.63 U$1.35-TX8
  Bottom 0.305: IC1.2 20.32,38.89 23.02,41.59 v23.81,41.59 | v41.12,62.23 41.27,62.39 v44.13,62.39 | v45.72,75.88 v45.72,72.71
N$1
  Top 0.305: IC1.4 27.94,35.56 R1.1
N$2  (via drill 0.33)
  Top 0.305: v12.22,62.55 7.94,62.55 OLED_CS.1
  Bottom 0.305: U$1.10-CS\MQSR 32.38,75.56 24.29,75.56 22.86,74.14 22.86,73.18 v12.22,62.55
N$3  (via drill 0.33)
  Top 0.305: U$1.11-MOSI/CTX1 36.04,73.66 34.77,74.93 31.27,74.93 30.48,74.14 30.48,73.18 28.89,71.6 22.86,71.6 v21.27,70.01
  Bottom 0.305: v21.27,70.01 18.41,67.15 18.41,61.75 10,53.34 OLED_DIN.1
N$4  (via drill 0.33)
  Top 0.305: OLED_CLK.1 v11.27,68.42
  Bottom 0.305: U$1.13-SCK/LED 29.05,78.58 17.94,78.58 16.51,77.15 16.51,75.41 15.24,74.14 15.24,72.39 v11.27,68.42
N$5
  Top 0.305: U$1.0-RX1/CS1/CRX2 6.35,71.12 RX.1
N$6
  Top 0.305: U$1.1-TX1/MISO1/CTX2 10.79,73.66 5.71,68.58 TX.1
N$7
  Top 0.305: KEY_X1.1 57.15,24.13 57.15,31.75 55.35,33.55 55.35,47.34 43.18,59.51 43.18,72.39 U$1.24-A10/TX6/SCL2
N$8
  Top 0.305: KEY_X2.1 57.84,25.98 57.84,32.03 56.03,33.84 56.03,47.63 46.99,56.67 U$1.25-A11/RX6/SDA2
N$9
  Top 0.305: KEY_Y1.1 58.09,35.89 58.09,48.48 54.61,51.96 U$1.28-RX7
N$10
  Top 0.305: KEY_Y2.1 58.78,37.74 58.78,48.77 57.15,50.39 U$1.29-TX7
N$11
  Top 0.305: KEY_Y5.1 61.06,43.08 61.06,69.95 U$1.32-OUT1B
N$12
  Top 0.305: KEY_X3.1 58.52,27.84 58.52,32.32 56.72,34.12 56.72,47.91 49.53,55.1 U$1.26-A12/MOSI1
N$13
  Bottom 0.305: U$1.6-OUT1D 24.13,71.6 19.68,67.15 19.68,62.71 23.81,58.58 37.94,58.58 44.45,52.07 44.45,49.53 45.72,48.26 50.8,48.26 55.88,43.18 MTX_CIN.1
N$14
  Top 0.305: STK_BTN.1 10.21,31.8 10.21,41.06 13.97,44.82 U$1.2-OUT2
N$15
  Top 0.305: KEY_Y6.1 61.75,44.93 61.75,68.92 65.98,73.16 65.98,74.16 64.77,75.37 U$1.33-MCLK2
N$16
  Top 0.305: KEY_Y3.1 59.69,39.37 U$1.30-CRX3
N$17
  Top 0.305: KEY_Y4.1 60.38,41.22 60.38,71.81 U$1.31-CTX3
N$18  (via drill 0.33)
  Top 0.305: v8.1,54.29 8.1,50.01 ENC_1.1
  Bottom 0.305: U$1.3-LRCLK2 16.51,70.33 8.1,61.91 v8.1,54.29
N$19  (via drill 0.33)
  Top 0.305: v10.79,58.1 10.79,50.16 ENC_2.1
  Bottom 0.305: U$1.4-BCLK2 19.05,71.75 10.48,63.18 10.48,58.42 v10.79,58.1
N$20  (via drill 0.33)
  Top 0.305: v12.22,60.01 12.22,49.05 ENC_BTN.1
  Bottom 0.305: U$1.5-IN2 21.59,73.18 11.27,62.87 11.27,60.96 v12.22,60.01
N$21
  Top 0.305: KEY_X4.1 59.21,29.69 59.21,32.6 57.4,34.41 57.4,48.2 52.07,53.53 U$1.27-A13/SCK1
N$22
  Top 0.305: STK_X.1 11.58,28.09 11.58,40.49 16.51,45.42 16.51,71.95 17.72,73.16 17.72,74.16 16.51,75.37 U$1.22-A8/CTX1
N$23
  Top 0.305: STK_Y.1 10.9,29.95 10.9,40.78 15.18,45.06 15.18,74.16 13.97,75.37 U$1.23-A9/CRX1/MCLK1
N$24  (via drill 0.33)
  Top 0.305: v18.1,90.81 17.3,90.81 17.14,90.96 6.51,90.96 5.08,89.53 v5.08,72.07
  Bottom 0.305: U$1.18-A4/SDA0 24.77,90.81 v18.1,90.81 | v5.08,72.07 3.97,70.96 3.97,63.34 1.59,60.96 OLED_RST.1
N$25
  Bottom 0.305: U$1.19-A5/SCL0 13.81,78.58 8.1,78.58 3.17,73.66 3.17,65.41 OLED_DC.1
N$26
  Top 0.305: 14.1 36.83,95.25 U$1.14-A0/TX3/SPDIF_OUT
N$27
  Top 0.305: IC1.5 30.48,35.56 R2.1
N$28
  Top 0.305: IC1.6 33.02,35.56 R3.1
N$29
  Top 0.305: R4.1 37.54,32.46 41.06,32.46 41.72,33.12 41.72,36.64 IC1.11
N$30
  Top 0.305: R5.1 39.4,31.77 41.35,31.77 42.4,32.83 42.4,34.78 IC1.12
N$31
  Top 0.305: R6.1 41.25,31.09 41.63,31.09 43.09,32.55 43.09,32.93 IC1.13
N$32
  Top 0.305: R7.1 IC1.14
N$33
  Top 0.305: IC1.15 50.8,40.39 51.92,39.27 51.92,36.68 R8.1
N$34
  Top 0.305: R9.1 48.26,32.05 52.6,36.39 52.6,46.21 51.26,47.55 50.34,47.55 48.51,45.72 IC1.16
N$35  (via drill 0.33)
  Top 0.305: R10.1 50.8,33.62 53.29,36.11 53.29,46.49 51.55,48.23 48.48,48.23 45.97,45.72 IC1.17 43.81,43.81 40.16,43.81 39.37,44.61 39.37,46.83 38.89,47.31 v38.89,50.32
  Bottom 0.305: LED_MOSI.1 35.88,53.34 v38.89,50.32
N$36
  Top 0.305: R11.1 53.34,35.19 53.98,35.83 53.98,46.78 51.83,48.92 46.63,48.92 43.43,45.72 IC1.18
  Bottom 0.305: LED_MISO.1 34.92,57.78 36.35,57.78 43.02,51.12 43.02,45.88 IC1.18
N$37
  Top 0.305: 15.1 34.29,95.25 U$1.15-A1/RX3/SPDIF_IN
N$38
  Top 0.305: IC1.1 18.52,38.84 18.52,39.81 22.58,43.87 23.3,43.87 24.28,44.85 24.28,46.89 28.19,50.8 LED_RST.1
N$39
  Top 0.305: R1.2 LED_R1.1 LED_R5.1 LED_R9.1 LED_R13.1 LED_R17.1 LED_R21.1
N$40
  Top 0.305: R2.2 LED_G1.1 LED_G5.1 LED_G9.1 LED_G13.1 LED_G17.1 LED_G21.1
N$41
  Top 0.305: R3.2 LED_B1.1 LED_B5.1 LED_B9.1 LED_B13.1 LED_B17.1 LED_B21.1
N$42
  Top 0.305: R4.2 LED_R2.1 LED_R6.1 LED_R10.1 LED_R14.1 LED_R18.1 LED_R22.1
N$43
  Top 0.305: R5.2 LED_G2.1 LED_G6.1 LED_G10.1 LED_G14.1 LED_G18.1 LED_G22.1
N$44
  Top 0.305: R6.2 LED_B2.1 LED_B6.1 LED_B10.1 LED_B14.1 LED_B18.1 LED_B22.1
N$45
  Top 0.305: R7.2 LED_R3.1 LED_R7.1 LED_R11.1 LED_R15.1 LED_R19.1 LED_R23.1
N$46
  Top 0.305: R8.2 LED_G3.1 LED_G7.1 LED_G11.1 LED_G15.1 LED_G19.1 LED_G23.1
N$47
  Top 0.305: R9.2 LED_B3.1 LED_B7.1 LED_B11.1 LED_B15.1 LED_B19.1 LED_B23.1
N$48
  Top 0.305: R10.2 LED_R4.1 LED_R8.1 LED_R12.1 LED_R16.1 LED_R20.1 LED_R24.1
N$49
  Top 0.305: R11.2 LED_G4.1 LED_G8.1 LED_G12.1 LED_G16.1 LED_G20.1 LED_G24.1
N$50
  Top 0.305: R12.2 LED_B4.1 LED_B8.1 LED_B12.1 LED_B16.1 LED_B20.1 LED_B24.1
N$51
  Top 0.305: Q1.2 9.53,20 12.38,22.86 R13.2
N$52
  Top 0.305: R13.1 12.7,40.64 IC1.28
N$53
  Top 0.305: Q2.2 12.06,16.83 13.34,18.1 13.34,20.95 R14.2
N$54
  Top 0.305: Q3.2 14.61,20 17.46,22.86 R15.2
N$55
  Top 0.305: Q4.2 17.14,16.83 18.41,18.1 18.41,20.95 R16.2
N$56
  Top 0.305: Q5.2 19.68,20 22.54,22.86 R17.2
N$57
  Top 0.305: Q6.2 22.23,16.83 25.4,20 R18.2
N$58
  Top 0.305: R14.1 15.24,40.64 IC1.27
N$59
  Top 0.305: R15.1 17.78,35.56 16.51,36.83 16.51,39.37 IC1.26
N$60
  Top 0.305: IC1.25 25.4,44.45 22.86,41.91 21.59,41.91 19.2,39.52 19.2,36.93 20.32,35.81 R16.1
N$61
  Top 0.305: R17.1 22.86,35.81 21.74,36.93 21.74,39.52 22.86,40.64 24.13,40.64 27.94,44.45 IC1.24
N$62
  Top 0.305: R18.1 25.4,35.81 24.28,36.93 24.28,39.52 IC1.23
N$63
  Top 0.305: Q6.1 24.13,14.29 22.86,13.02 22.86,6.35 LED_C1.1
N$64
  Top 0.305: Q5.1 21.59,19.37 20.32,18.1 20.32,6.35 LED_C2.1
N$65
  Top 0.305: Q4.1 19.05,14.29 17.78,13.02 17.78,6.35 LED_C3.1
N$66
  Top 0.305: 36.1 57.15,90.17 U$1.36-PWM
N$67
  Top 0.305: 37.1 54.61,90.17 U$1.37-PWM
N$68
  Top 0.305: Q3.1 16.51,19.37 15.24,18.1 15.24,6.35 LED_C4.1
N$69
  Top 0.305: Q2.1 13.97,14.29 12.7,13.02 12.7,6.35 LED_C5.1
N$70
  Top 0.305: Q1.1 11.43,19.37 10.16,18.1 10.16,6.35 LED_C6.1
N$71
  Top 0.305: 16.1 31.75,95.25 U$1.16-A2/RX4/SCL1
N$72
  Top 0.305: 17.1 29.21,95.25 U$1.17-A3/TX4/SDA1
N$73
  Top 0.305: 7.1 25.4,93.98 25.4,74.93 U$1.7-RX2/OUT1A
N$74
  Top 0.305: U$1.8-TX2/IN1 27.94,74.93 27.94,93.98 8.1
N$75
  Top 0.305: U$1.20-A6/TX5/LRCLK1 21.59,95.25 20.1
N$76
  Top 0.305: U$1.21-A7/RX5/BCLK1 19.05,94.3 15.24,98.11 21.1
N$77  (via drill 0.33)
  Top 0.305: U$1.9-OUT1C 32.54,73.66 34.13,72.07 v42.23,72.07 | v55.56,70.01 55.56,58.74 v56.2,58.1 | MTX_DIN.1 v62.71,51.59
  Bottom 0.305: v42.23,72.07 44.29,70.01 v55.56,70.01 | v62.71,51.59 v56.2,58.1
N$79
  Top 0.305: 38.1 52.07,90.17 U$1.38-A14/CS/IN1
N$80
  Top 0.305: 39.1 49.53,90.17 U$1.39-A15/CS/OUT1A
N$81
  Top 0.305: 40.1 46.99,90.17 U$1.40-A16/CS1
N$82
  Top 0.305: 41.1 44.45,90.17 U$1.41-A17/MISO1
N$83
  Top 0.305: Q7.1 35.6,35.6 IC1.9
N$84
  Top 0.305: Q7.3 40.6,38.06 IC1.10
N$86  (via drill 0.33)
  Top 0.305: R12.1 54.66,31.7 54.66,47.06 52.12,49.61 44.53,49.61 IC1.19 | LED_SCK.1 33.81,53.34 35.08,52.07 36.04,52.07 36.99,51.12 v36.99,49.85
  Bottom 0.305: v36.99,49.85 40.64,46.2 IC1.19

### Text on the board
tNames: Rob Ellis 2020 | GND | +5V | -12V | +12V | LED_R | LED_G | LED_B | LED_R | LED_G | LED_B | LED_R | LED_G | LED_B | LED_R | LED_G | LED_B | LED_C